# Altium schematic sheet TopSheet.SchDoc
size A4; CompanyName: Technische Hochschule Nürnberg Georg Simon Ohm; Organization: UltraZohm; Address1: Kesslerplatz 12; Address2: 90489 Nürnberg; Address3: GERMANY; DocumentNumber: 1; SheetNumber: 1; SheetTotal: 2; Website: www.ultrazohm.com
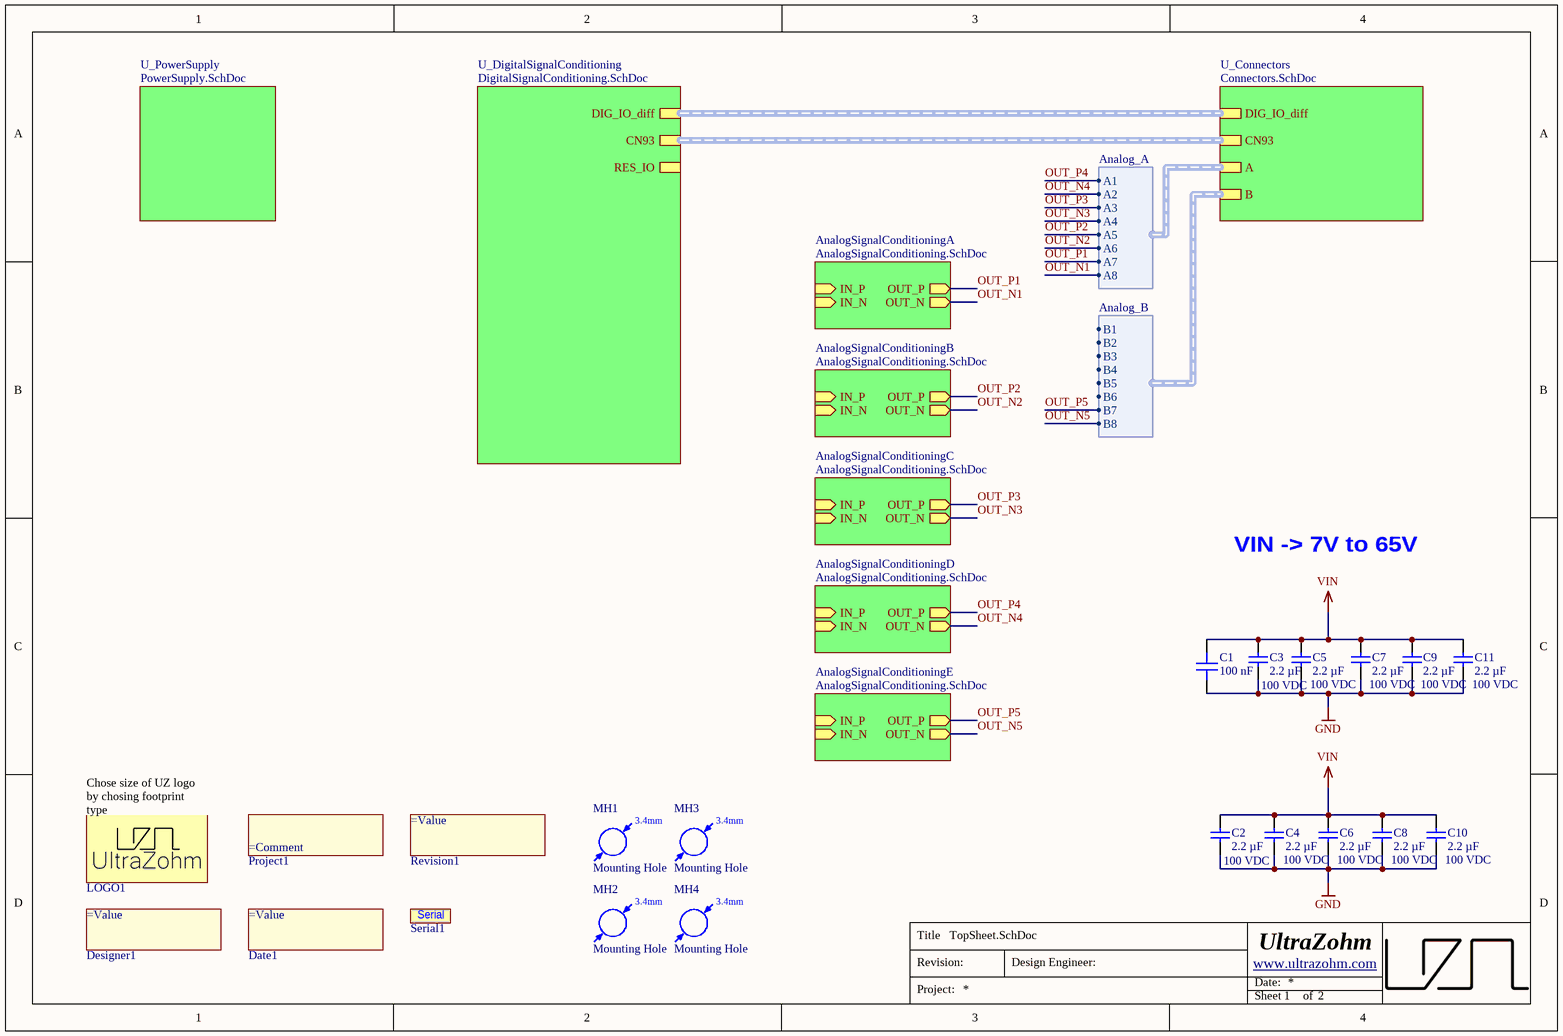
[diagram p0: TopSheet.SchDoc]

## Parts
C1  100 nF  [C_0603]
C2  2.2 µF  Voltage Rating: 100 VDC  [C_1210_TE]
C3  2.2 µF  Voltage Rating: 100 VDC  [C_1210_TE]
C4  2.2 µF  Voltage Rating: 100 VDC  [C_1210_TE]
C5  2.2 µF  Voltage Rating: 100 VDC  [C_1210_TE]
C6  2.2 µF  Voltage Rating: 100 VDC  [C_1210_TE]
C7  2.2 µF  Voltage Rating: 100 VDC  [C_1210_TE]
C8  2.2 µF  Voltage Rating: 100 VDC  [C_1210_TE]
C9  2.2 µF  Voltage Rating: 100 VDC  [C_1210_TE]
C10  2.2 µF  Voltage Rating: 100 VDC  [C_1210_TE]
C11  2.2 µF  Voltage Rating: 100 VDC  [C_1210_TE]
Date1  (no value)  [COMMENT]  (no BOM)
Designer1  (no value)  [Designator:comment]  (no BOM)
LOGO1  UZ Logo  [UZ_Logo_small]  (value not drawn)  (no BOM)
MH1  Mounting Hole  [MH_3.4]
MH2  Mounting Hole  [MH_3.4]
MH3  Mounting Hole  [MH_3.4]
MH4  Mounting Hole  [MH_3.4]
Project1  (no value)  [COMMENT]  (no BOM)
Revision1  (no value)  [Designator:comment]  (no BOM)
Serial1  Serial #  [SERIAL]  (value not drawn)

## Sub-sheets
AnalogSignalConditioningA = AnalogSignalConditioning.SchDoc: OUT_P (out), OUT_N (out), IN_P (in), IN_N (in)
AnalogSignalConditioningB = AnalogSignalConditioning.SchDoc: OUT_P (out), OUT_N (out), IN_P (in), IN_N (in)
AnalogSignalConditioningC = AnalogSignalConditioning.SchDoc: OUT_P (out), OUT_N (out), IN_P (in), IN_N (in)
AnalogSignalConditioningD = AnalogSignalConditioning.SchDoc: OUT_P (out), OUT_N (out), IN_P (in), IN_N (in)
AnalogSignalConditioningE = AnalogSignalConditioning.SchDoc: OUT_P (out), OUT_N (out), IN_P (in), IN_N (in)
U_Connectors = Connectors.SchDoc: DIG_IO_diff (harness DIG_IO_diff), CN93 (harness Connector CN93), A (harness Analog_A), B (harness Analog_B)
U_DigitalSignalConditioning = DigitalSignalConditioning.SchDoc: DIG_IO_diff (harness DIG_IO_diff), CN93 (harness Connector CN93), RES_IO (harness RES_IO)
U_PowerSupply = PowerSupply.SchDoc: no entries

## Harnesses
Analog_A: A1, A2, A3, A4, A5, A6, A7, A8
Analog_B: B1, B2, B3, B4, B5, B6, B7, B8

## Nets
GND: C1.2 C2.2 C3.2 C4.2 C5.2 C6.2 C7.2 C8.2 C9.2 C10.2 C11.2
VIN: C1.1 C2.1 C3.1 C4.1 C5.1 C6.1 C7.1 C8.1 C9.1 C10.1 C11.1
OUT_N1: sheet AnalogSignalConditioningA/OUT_N, sheet U_Connectors/A.A8
OUT_N2: sheet AnalogSignalConditioningB/OUT_N, sheet U_Connectors/A.A6
OUT_N3: sheet AnalogSignalConditioningC/OUT_N, sheet U_Connectors/A.A4
OUT_N4: sheet AnalogSignalConditioningD/OUT_N, sheet U_Connectors/A.A2
OUT_N5: sheet AnalogSignalConditioningE/OUT_N, sheet U_Connectors/B.B8
OUT_P1: sheet AnalogSignalConditioningA/OUT_P, sheet U_Connectors/A.A7
OUT_P2: sheet AnalogSignalConditioningB/OUT_P, sheet U_Connectors/A.A5
OUT_P3: sheet AnalogSignalConditioningC/OUT_P, sheet U_Connectors/A.A3
OUT_P4: sheet AnalogSignalConditioningD/OUT_P, sheet U_Connectors/A.A1
OUT_P5: sheet AnalogSignalConditioningE/OUT_P, sheet U_Connectors/B.B7

## Buses and harness runs
harness sheet U_Connectors/CN93 = sheet U_DigitalSignalConditioning/CN93
harness sheet U_Connectors/DIG_IO_diff = sheet U_DigitalSignalConditioning/DIG_IO_diff

## Notes on the sheet
- VIN -> 7V to 65V
- (near LOGO1) Chose size of UZ logo by chosing footprint type
- Title
- Revision:
- Design Engineer:
- Date:
- Project:
- Sheet
- of
- (in symbol 6) Serial
- (in symbol Mounting Hole) 3.4mm

## Library data of the parts
C1 = C1608X7S2A104KT000N: 100V 100nF X7S ±10% 0603 Multilayer Ceramic Capacitors MLCC - SMD/SMT ROHS; Manufacturer: TDK; Voltage Rating: 100 VDC; Created from: AGeiger; Value: 100 nF; Supplier 1: LCSC; Supplier Part Number 1: C343025; Tolerance: 10 %; LCSC Part Number: C343025; Manufacturer Part Number: C1608X7S2A104KT000N; PartID: 148; Created On: 20/12/2020 13:54:13; ComponentLink1Description: Datasheet; ComponentLink1URL: https://datasheet.lcsc.com/lcsc/2304140030_TDK-C1608X7S2A104KT000N_C343025.pdf; Component Type: Capacitor 0603; Device Package: 0603; Last Updated: 14/12/2022 12:14:21; Mounting Type: SMD; Operating Temperature: -55 to 125°C; Series: X7R; Type: Capacitor; Live Cycle Status: 1; Stock number: not stored
C2-C11 = FS32X225K101EGG: 100V 2.2uF X7R ±10% 1210 Multilayer Ceramic Capacitors MLCC - SMD/SMT ROHS; Manufacturer: PSA(Prosperity Dielectrics); Created from: AGeiger; Manufacturer Part Number: FS32X225K101EGG; PartID: 170; Created On: 11.03.2025 16:22:30; ComponentLink1Description: Datasheet; ComponentLink1URL: https://www.lcsc.com/datasheet/lcsc_datasheet_2410121308_PSA-Prosperity-Dielectrics-FS32X225K101EGG_C153036.pdf; Component Type: Capacitor 1210; Device Package: 1210; Last Updated: 27.05.2025 19:11:48; Mounting Type: SMD; Operating Temperature: -55 to +125°C; Series: FS; Supplier 1: LCSC; Supplier Part Number 1: C153036; Type: Capacitor; Tolerance: 10%; Value: 2.2 µF; Live Cycle Status: 1; LCSC Part Number: C153036
Date1 = 5: Create a project parameter named "FinDate" this is the value of this component. It is printed on the PCB. Once the parameter is updated (e.g. new revision) it gets updated on the PCB as well; Manufacturer: PCB Manufacturer; Manufacturer Part Number: Project End Date; Created from: T. Wendt; PartID: 5; Created On: 01.03.2021 09:01:41; Component Type: Date of Project Finalization; Last Updated: 01.03.2021 09:01:41; Type: Standard (No BOM); Value: =FinDate; Live Cycle Status: 1
Designer1 = 4: Create a project parameter named "Author" this is the value of this component. It is printed on the PCB. Once the parameter is updated (e.g. new revision) it gets updated on the PCB as well; Manufacturer: PCB Manufacturer; Manufacturer Part Number: Project Author; Created from: T. Wendt; PartID: 4; Created On: 01.03.2021 08:53:41; Component Type: Project Author; Last Updated: 01.03.2021 09:20:27; Type: Standard (No BOM); Value: =AuthorParam; Live Cycle Status: 1
LOGO1 = 1: Official Project Logo of the UltraZohm; Manufacturer: PCB Manufacturer; Manufacturer Part Number: UltraZohm Logo; Created from: T. Wendt; PartID: 1; Created On: 19.02.2021 16:55:56; ComponentLink1Description: Homepage; ComponentLink1URL: https://ultrazohm.com; Component Type: Logo; Last Updated: 02.03.2021 14:31:24; Type: Standard (No BOM); Live Cycle Status: 1
MH1-MH4 = Mounting Hole: Created from: MHlatky; Manufacturer Part Number: Mounting Hole; PartID: 16; Created On: 26.01.2021 09:19:51; ComponentLink1Description: Datasheet; Component Type: Mounting Hole; Device Package: -; Last Updated: 21.03.2022 23:05:12; Manufacturer: Mounting Hole; Supplier 1: Mounting Hole; Supplier Part Number 1: Mounting Hole; Type: Mounting Hole; Value: Mounting Hole; Live Cycle Status: 1; Stock number: not stored
Project1 = 2: Create a project parameter named "ProjectNameCustom" this is the value of this component and it is printed on the PCB.; Manufacturer: PCB Manufacturer; Created from: T. Wendt; PartID: 2; Created On: 01.03.2021 08:43:57; Component Type: Project Name; Last Updated: 01.03.2021 09:07:27; Manufacturer Part Number: Project Name; Type: Standard (No BOM); Value: =ProjectNameCustom; Live Cycle Status: 1
Revision1 = 3: Create a project parameter named "ProjectRevision" this is the value of this component. It is printed on the PCB. Once the parameter is updated (e.g. new revision) it gets updated on the PCB as well; Manufacturer: PCB Manufacturer; Created from: T. Wendt; PartID: 3; Created On: 01.03.2021 08:50:34; Component Type: Project Revision; Last Updated: 01.03.2021 09:28:36; Manufacturer Part Number: Project Revision; Type: Standard (No BOM); Value: =ProjectRevision; Live Cycle Status: 1
Serial1 = 6: Field to put in a serial number; Manufacturer: PCB Manufacturer; Created from: T. Wendt; PartID: 6; Created On: 02.03.2021 14:31:24; Component Type: Serial Number; Last Updated: 02.03.2021 14:31:24; Manufacturer Part Number: Serial Number; Type: Standard (No BOM); Live Cycle Status: 1